# EAGLE design MCP9808 (EAGLE 7.7.0)
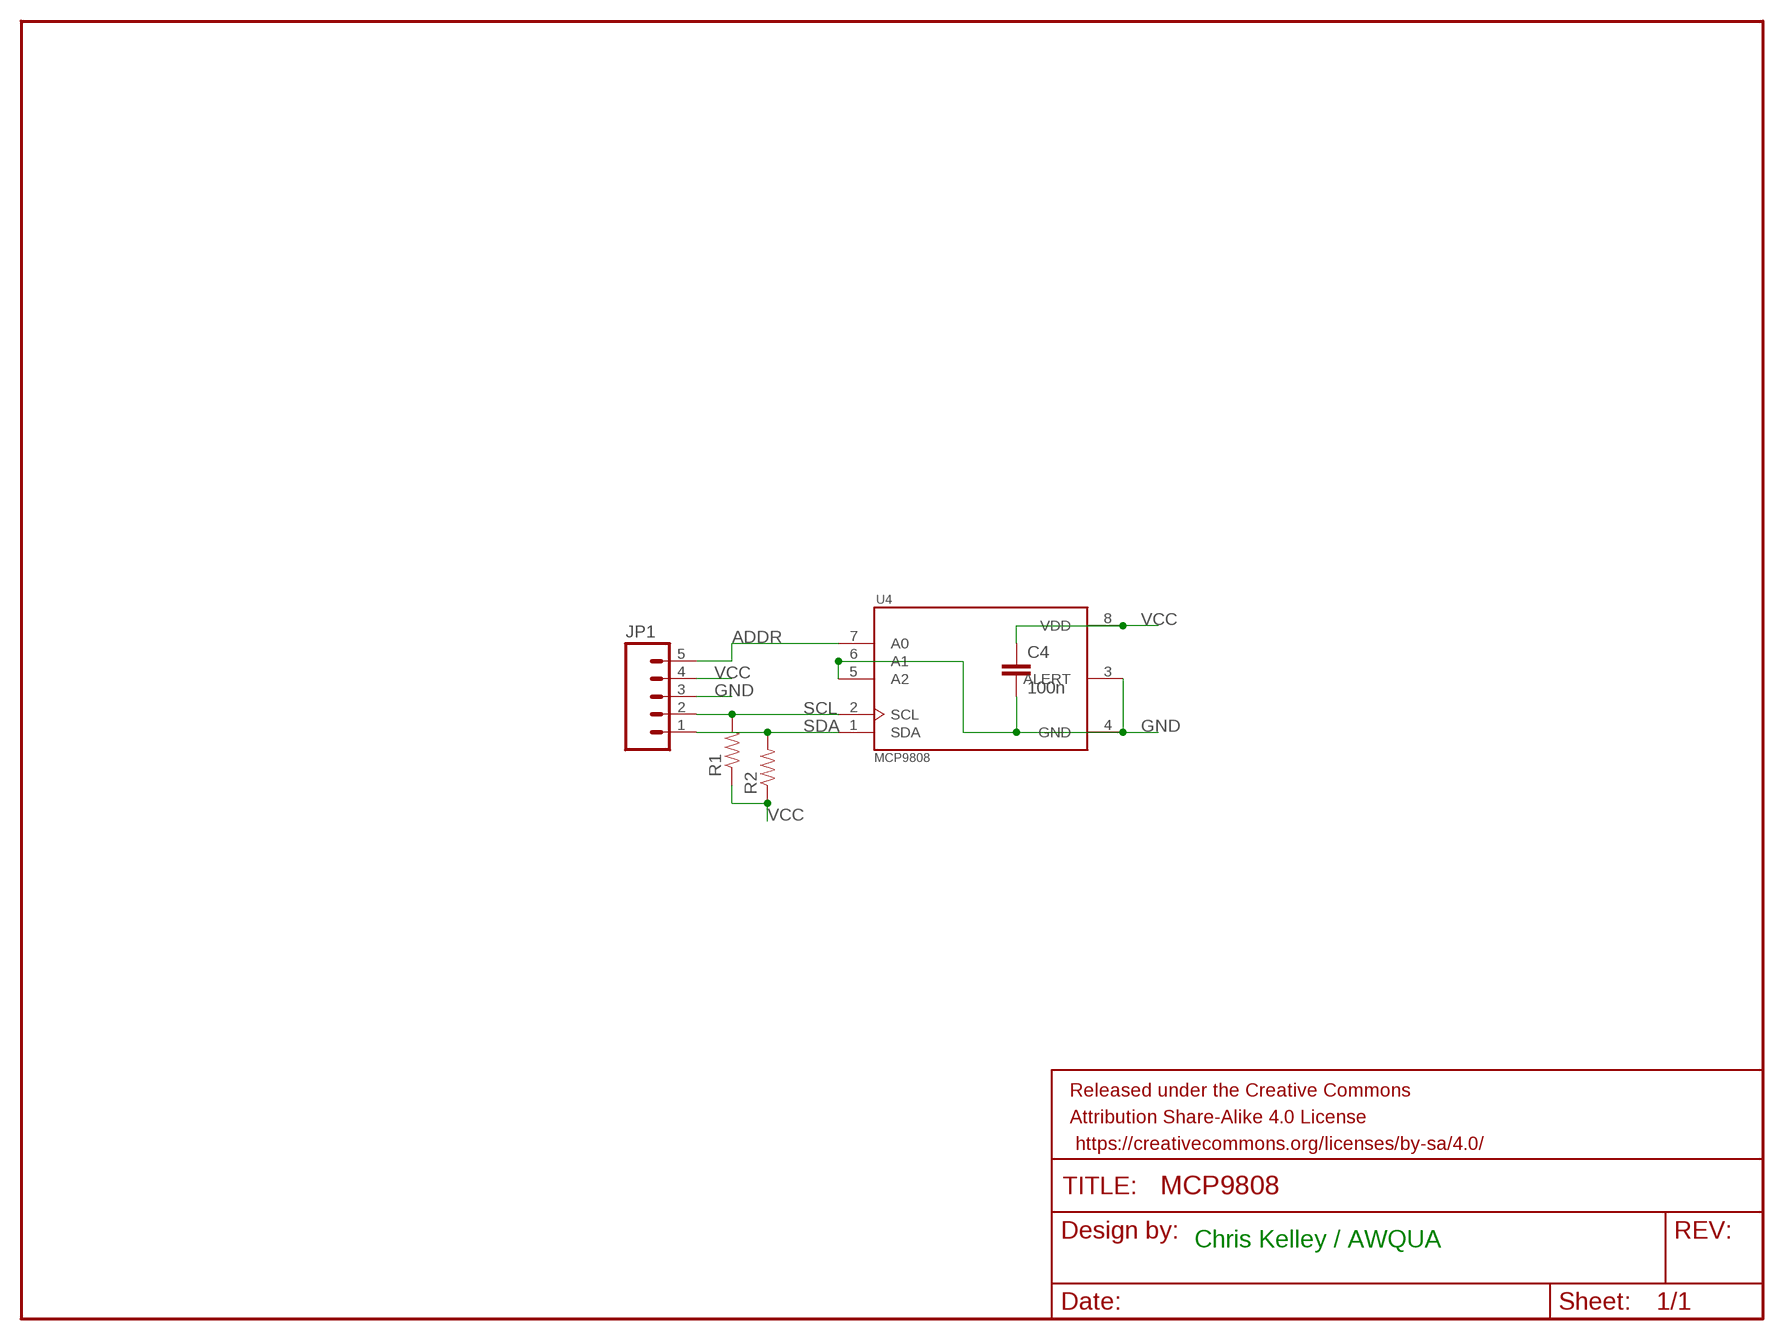
[diagram p0: schematic, sheet 1]

## Parts
C4  100n  CAP0603-CAP  [0603-CAP]
FRAME1  FRAME-LETTER  [CREATIVE_COMMONS]
JP1  M05PTH  [1X05]
R1  RESISTOR0603-RES  [0603-RES]
R2  RESISTOR0603-RES  [0603-RES]
U4  MCP9808  MCP9808-E/MS  [SOP65P490X110-8N]

## Nets
ADDR: JP1.5 U4.7(A0)
GND: C4.2 JP1.3 U4.3(ALERT) U4.4(GND) U4.5(A2) U4.6(A1)
SCL: JP1.2 R1.2 U4.2(SCL)
SDA: JP1.1 R2.2 U4.1(SDA)
VCC: C4.1 JP1.4 R1.1 R2.1 U4.8(VDD)

## Notes on the sheet
- Chris Kelley / AWQUA

## Library data of the parts
C4 = SparkFun:CAP: Capacitor Standard 0603 ceramic capacitor, and 0.1" leaded capacitor.
FRAME1 = SparkFun-Aesthetics:FRAME-LETTER: Schematic Frame Standard 8.5x11 US Letter frame
JP1 = SparkFun-Connectors:M05: Header 5 Standard 5-pin 0.1" header. Use with straight break away headers (SKU : PRT-00116), right angle break away headers (PRT-00553), swiss pins (PRT-00743), machine pins (PRT-00117), and female headers (PRT-00115). Molex polarized connector foot print use with SKU : PRT-08230 with associated crimp pins and housings.
R1 R2 = SparkFun-Passives:RESISTOR: Resistor Basic schematic elements and footprints for 0603, 1206, and PTH resistors.
U4 = MCP9808-E_MS:MCP9808-E/MS: Board Mount Temperature Sensors Silicon temp sensor with I2C interface; AVAILABILITY: Good; DESCRIPTION: MCP9808 Series SMD 3.6 V Memory Module Digital Temperature Sensor - MSOP-8; MF: Microchip; MP: MCP9808-E/MS; PACKAGE: MSOP-8 Microchip; PRICE: 1.03 USD

## Board
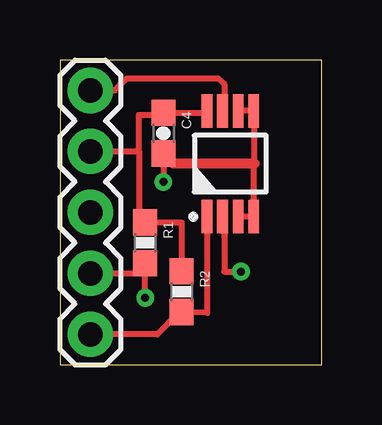
[diagram p1: board, top side]
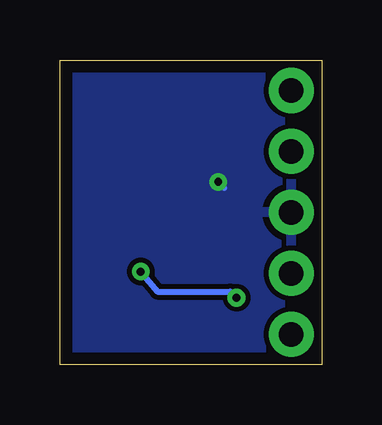
[diagram p2: board, bottom side, seen from below]

Size 10.92 x 12.7 mm. Coordinates in mm from the lower left corner, seen from the top.
Outline: 0,0 10.92,0 10.92,12.7 0,12.7 0,0
Copper layers (1*16): Top 0.035mm / dielectric 1.5mm / Bottom 0.035mm
Design rules "default *": minimum track width 10mil, minimum drill 24mil, track to track 8mil, track to pad 8mil, pad to pad 8mil, via to via 8mil, smd to smd 8mil, copper to edge 20mil, drill to drill 8mil, minimum pad ring 10mil, minimum via ring 8mil, stop-mask expansion 4mil, vias tented up to drill 13mil, thermal gap 10mil

### Footprints (pad centres in the part's own frame; a part is rotated, then mirrored left to right if it is on the bottom)
0603-CAP = smd 1.1 x 1: 1 -0.85,0; 2 0.85,0
1X05 = drill 1.016 pad 1.88: 1 0,0; 2 2.54,0; 3 5.08,0; 4 7.62,0; 5 10.16,0
0603-RES = smd 1.1 x 1: 1 -0.85,0; 2 0.85,0
SOP65P490X110-8N = smd 1.4 x 0.45: 1 -2.2,0.975; 2 -2.2,0.325; 3 -2.2,-0.325; 4 -2.2,-0.975; 5 2.2,-0.975; 6 2.2,-0.325; 7 2.2,0.325; 8 2.2,0.975

### Placement (x,y rotation side)
C4  4.32,9.65 270 top
FRAME1  17.78,-12.7 0 top  (outside the outline)
JP1  1.27,1.27 90 top
R1  3.56,5.08 270 top
R2  5.08,3.05 270 top
U4  7.11,8.38 90 top

### Tracks (layer width: path | path; a pad name or v marks a point on that pad's centre or on a via)
ADDR
  Top 0.254: JP1.5 2.29,11.43 2.79,11.94 6.6,11.94 6.86,11.68 6.86,10.65 U4.7
GND  (via drill 0.33)
  Top 0.254: U4.6 U4.5 8.09,8.42 8.13,8.38 8.09,8.34 8.09,6.35 | U4.3 U4.4 | C4.2 v4.32,7.62
  Top 0.406: U4.4 8.09,6.35 | 8.13,8.38 4.74,8.38 C4.2
  Bottom 0.254: v4.32,7.62 4.06,7.37
  pour Bottom: -3.05,15.49 19.05,15.49 19.05,-4.06 -3.05,-4.06
SCL  (via drill 0.33)
  Top 0.254: JP1.2 3.14,3.81 R1.2 v3.56,2.79 | U4.2 6.86,5.33 6.86,3.88 v7.55,3.88
  Bottom 0.254: v7.55,3.88 6.86,3.05 3.81,3.05 v3.56,2.79
SDA
  Top 0.254: U4.1 6.14,2.16 R2.2 4.91,2.12 4.06,1.27 JP1.1
VCC
  Top 0.254: JP1.4 3.3,8.89 | 3.3,8.89 3.3,10.41 4.23,10.41 C4.1 6.06,10.5 U4.8 | 3.3,8.89 3.3,6.1 R1.1 5.08,5.93 R2.1

### Text on the board
tPlace: Chris Kelley / AWQUA